# Altium project LB V01 R03.PrjPcb
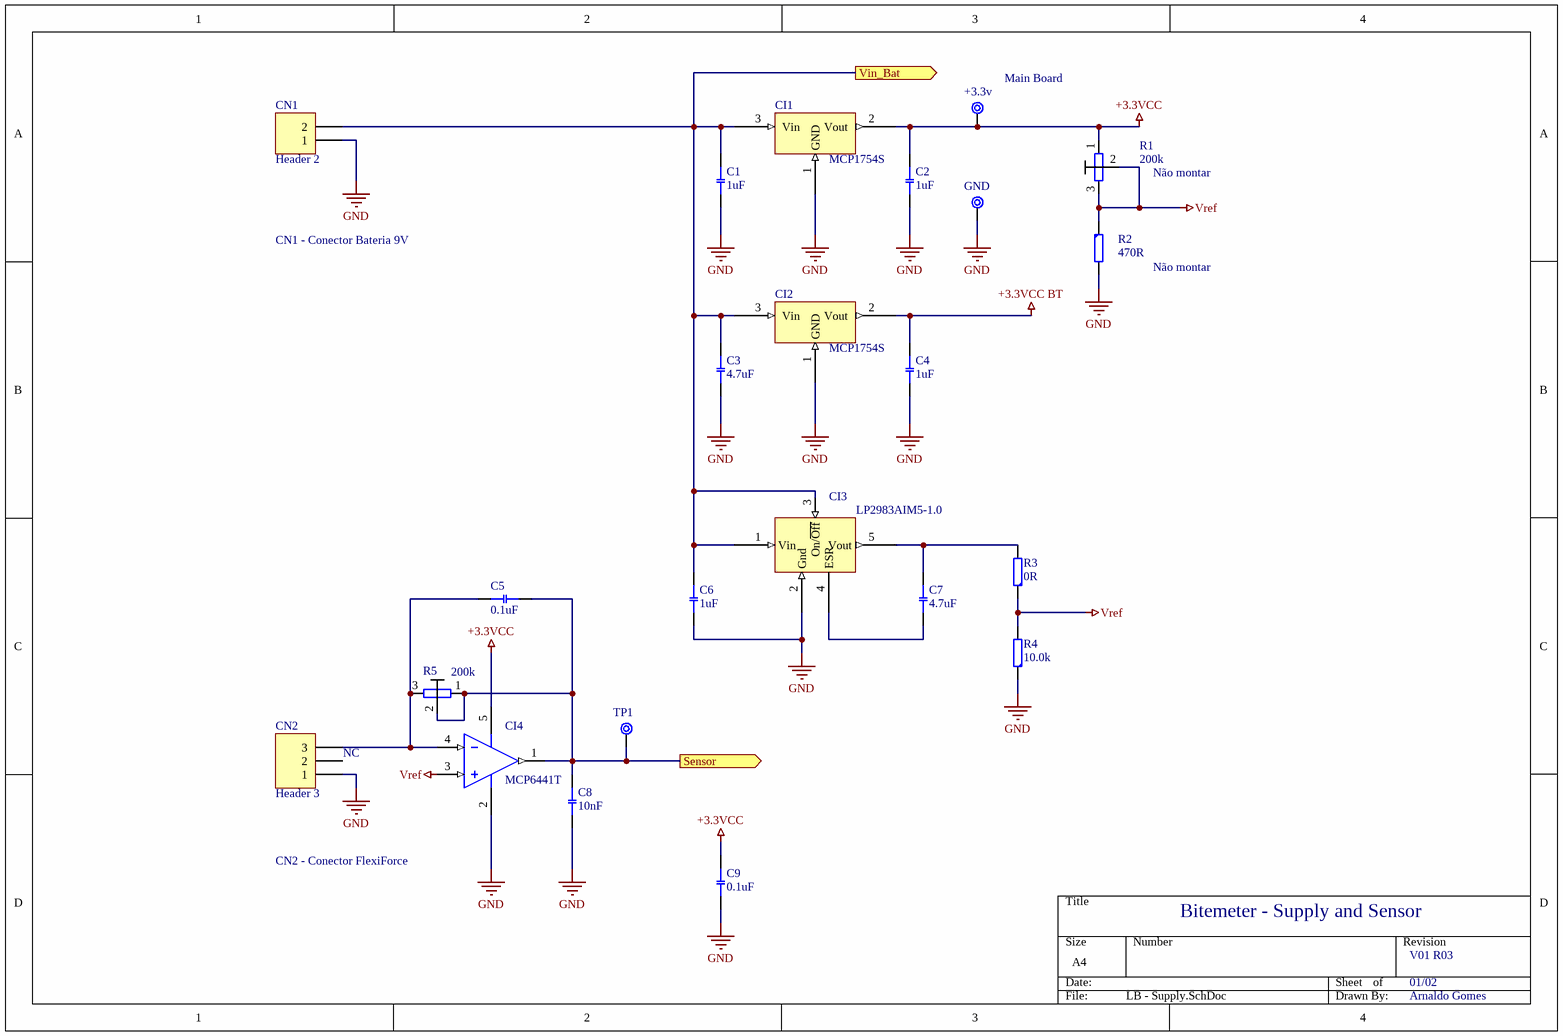
[diagram p0: LB - Supply.SchDoc]
2 sheets, 60 parts. Net scope: flat (ports and power ports of the same name join across sheets).
Board files: LB - PCB Route.PcbDoc, LB - PCB Route Sem a malha de terra.PcbDoc
Sheets:
  LB - Supply.SchDoc
  LB - MainBoard.SchDoc

## Sheet LB - Supply.SchDoc
size A4

### Parts
+3.3v  TP  [TPSMD]  (value not drawn)  (no BOM)
C1  1uF  [R0805]
C2  1uF  [R0805]
C3  4.7uF  [R0805]
C4  1uF  [R0805]
C5  0.1uF  [R0805]
C6  1uF  [R0805]
C7  4.7uF  [R0805]
C8  10nF  [R0805]
C9  0.1uF  [R0805]
CI1  MCP1754S  [SOT23-A MCP1754]
CI2  MCP1754S  [SOT23-A MCP1754]
CI3  LP2983AIM5-1.0  [SOT23-5 Amp Op]
CI4  MCP6441T  [SOT23-5 Amp Op]
CN1  Header 2  [HDR1X2]
CN2  Header 3  [HDR1X3]
GND  TP  [TPSMD]  (value not drawn)  (no BOM)
R1  200k  [3364X-1-503E]
R2  470R  [R0805]
R3  0R  [R0805]
R4  10.0k  [R0805]
R5  200k  [3364X-1-503E]
TP1  TP  [TPSMD]  (value not drawn)  (no BOM)

### Ports
Sensor (out), Vin_Bat (out)

### Nets
+3.3VCC: +3.3v.1 C2.2(B) C9.2(B) CI1.2(Vout) CI4.5(VDD) R1.1(B)
+3.3VCC BT: C4.2(B) CI2.2(Vout)
GND: C1.1(A) C2.1(A) C3.1(A) C4.1(A) C6.2(B) C8.1(A) C9.1(A) CI1.1(GND) CI2.1(GND) CI3.2(Gnd) CI4.2(VSS) CN1.1 CN2.1 GND.1 R2.2(B) R4.1(A)
Vref: CI4.3(Vin+) R1.2(C) R1.3(A) R2.1(A) R3.1(A) R4.2(B)
Sensor_Mord: C5.1(A) C8.2(B) CI4.1(Vout) R5.1(B) R5.2(C) TP1.1 ; port Sensor
NetC1_2: C1.2(B) C3.2(B) C6.1(A) CI1.3(Vin) CI2.3(Vin) CI3.1(Vin) CI3.3(On/~{Off}) CN1.2 ; port Vin_Bat
NetC5_2: C5.2(B) CI4.4(Vin-) CN2.3 R5.3(A)
NetC7_1: C7.1(A) CI3.4(ESR)
NetC7_2: C7.2(B) CI3.5(Vout) R3.2(B)

Not connected (* = marked no-connect by the designer): CN2 2

### Notes on the sheet
- (near +3.3v) Main Board
- (near R1) Não montar
- CN1 - Conector Bateria 9V
- Não montar
- (near CN2) NC
- CN2 - Conector FlexiForce
- Bitemeter - Supply and Sensor
- V01 R03
- 01/02
- Arnaldo Gomes

### Library data of the parts
+3.3v GND TP1 = TP: Test Point
C1 = C: Capictor Cerâmico 4.7uFx16V; PN_Fab: C2012X7R1C105K125AA; PN_For: 445-1358-1-ND; Ref_Fab: TDK Corporation; Ref_For: Digikey
C2 C4 C6 = C: Capictor Cerâmico 1uFx16V; PN_Fab: C2012X7R1C105K125AA; PN_For: 445-1358-1-ND; Ref_Fab: TDK Corporation; Ref_For: Digikey
C3 C7 = C: Capictor Cerâmico 4.7uFx16V; PN_Fab: C2012X7R1C475K125AB; PN_For: 445-6859-1-ND; Ref_Fab: TDK Corporation; Ref_For: Digikey
C5 C9 = C: Capacitor 0.1uFx25V; PN_Fab: C2012X7R1H104K085AA; PN_For: 445-7534-1-ND; Ref_Fab: Murata Electronics North America; Ref_For: Digikey
C8 = C: Capacitor 10nFx25V; PN_Fab: C2012C0G1H103K060AA; PN_For: 445-14311-1-ND; Ref_Fab: TDK Corporation; Ref_For: Digikey
CI1 CI2 = Regulador 3.3V - SOT223-3, 4-Leads, Body 6.50x7.00mm (avg), Pitch 2.30mm, IPC Medium_1: Regulador 3.3V MCP1754S; PN_Fab: MCP1754ST-3302E/CB; PN_For: MCP1754ST-3302E/CBCT-ND; Ref_Fab: Microchip Technology; Ref_For: Digikey
CI3 = Regulador 1.0V - SOT23-5: Regulador 1.0V; LP2983AIM5-1.0/NOPB: PN_Fab; LP2983AIM5-1.0/NOPBCT-ND: PN_For; Texas Instruments: Ref_Fab; Digikey: Ref_For
CI4 = Amp Op: Amp Op Rail-to-Rail; PN_Fab: MCP6441T-E/OT; PN_For: MCP6441T-E/OTCT-ND; Ref_Fab: Linear Technology; Ref_For: Digikey
CN1 = Conector Alimentação: Header, 2-Pin; Ref_Fab: TE Connectivity; Ref_For: Digikey; PN_Fab: 640456-2; PN_For: A1921-ND
CN2 = Conector Sensor: Header, 3-Pin; PN_Fab: 640457-3; PN_For: A19480-ND; Ref_For: TE Connectivity; Ref_For: Digikey
R1 = Trimpot: Trimpot 200k; PN_Fab: 3364X-1-204E; PN_For: 3364X-204ETR-ND; Ref_Fab: Bourns Inc.; Ref_For: Digikey
R2 = R: PN_Fab: MCR10ERTJ471; PN_For: RHM470CPCT-ND; Ref_Fab: Rohm Semiconductor; Ref_For: Digikey
R3 = R: PN_Fab: RHM0.0CPCT-ND; PN_For: MCR10ERTJ000; Ref_Fab: Rohm Semiconductor; Ref_For: Digikey
R4 = R: PN_Fab: MCR10ERTF1002; PN_For: RHM10.0KCHCT-ND; Ref_Fab: Rohm Semiconductor; Ref_For: Digikey
R5 = Trimpot: Trimpot 500k; PN_Fab: 3364X-1-504E; PN_For: 3364X-504ECT-ND; Ref_Fab: Bourns Inc.; Ref_For: Digikey

## Sheet LB - MainBoard.SchDoc
size A4
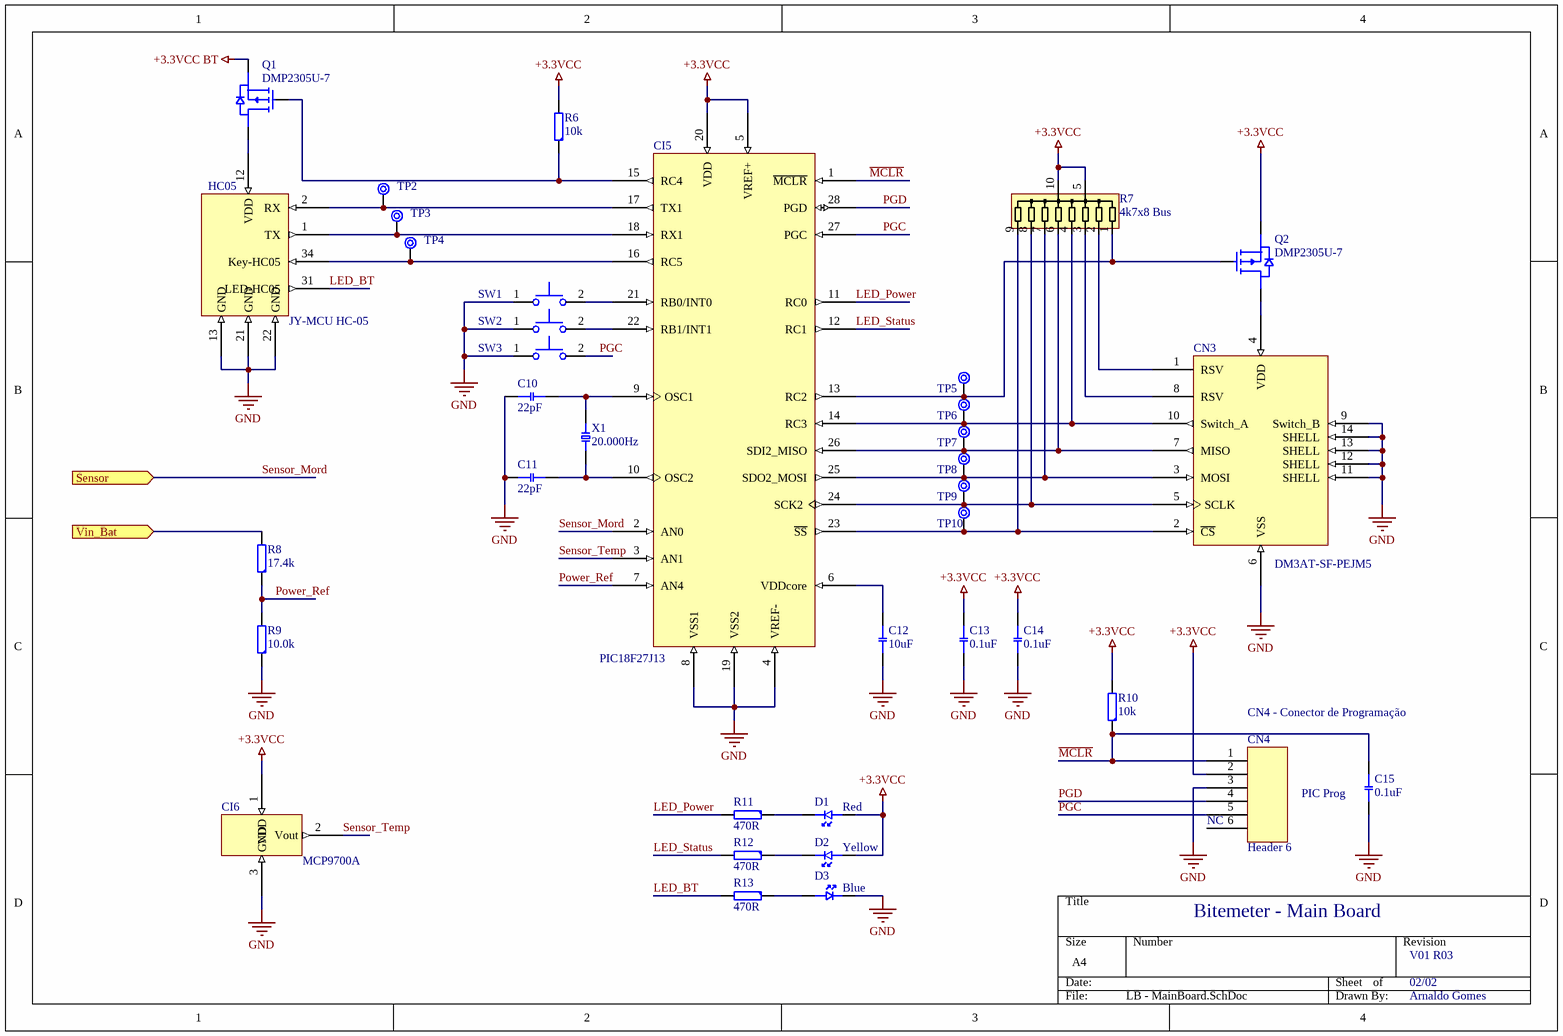
[diagram p1: LB - MainBoard.SchDoc]

### Parts
C10  22pF  [R0805]
C11  22pF  [R0805]
C12  10uF  [R0805]
C13  0.1uF  [R0805]
C14  0.1uF  [R0805]
C15  0.1uF  [R0805]
CI5  PIC18F27J13  [PIC24F16KL402]
CI6  MCP9700A  [MCP9700A]
CN3  DM3AT-SF-PEJM5  [DM3AT]
CN4  Header 6  [HDR1X6]
D1  Red  [LTST-C930]
D2  Yellow  [LTST-C930]
D3  Blue  [LTST-C930]
HC05  JY-MCU HC-05  [JY-MCU HC-05]
Q1  DMP2305U-7  [DMP2305U-7]
Q2  DMP2305U-7  [DMP2305U-7]
R6  10k  [R0805]
R7  4k7x8 Bus  [MMR15 Mod]
R8  17.4k  [R0805]
R9  10.0k  [R0805]
R10  10k  [R0805]
R11  470R  [R0805]
R12  470R  [R0805]
R13  470R  [R0805]
SW1  (no value)  [Push Button2]
SW2  (no value)  [Push Button2]
SW3  (no value)  [Push Button2]
TP2  TP  [TPSMD]  (value not drawn)  (no BOM)
TP3  TP  [TPSMD]  (value not drawn)  (no BOM)
TP4  TP  [TPSMD]  (value not drawn)  (no BOM)
TP5  TP  [TPSMD]  (value not drawn)  (no BOM)
TP6  TP  [TPSMD]  (value not drawn)  (no BOM)
TP7  TP  [TPSMD]  (value not drawn)  (no BOM)
TP8  TP  [TPSMD]  (value not drawn)  (no BOM)
TP9  TP  [TPSMD]  (value not drawn)  (no BOM)
TP10  TP  [TPSMD]  (value not drawn)  (no BOM)
X1  20.000Hz  [ABM3]

### Ports
Sensor (in), Vin_Bat (in)

### Nets
+3.3VCC: C13.2(B) C14.2(B) CI5.5(VREF+) CI5.20(VDD) CI6.1(VDD) CN4.2 D1.A D2.A Q2.S R6.2(B) R7.5 R7.10 R10.2(B)
+3.3VCC BT: Q1.S
GND: C10.2(B) C11.2(B) C12.1(A) C13.1(A) C14.1(A) C15.1(A) CI5.4(VREF-) CI5.8(VSS1) CI5.19(VSS2) CI6.3(GND) CN3.6(VSS) CN3.9(Switch_B) CN3.11(SHELL) CN3.12(SHELL) CN3.13(SHELL) CN3.14(SHELL) CN4.3 D3.K HC05.13(GND) HC05.21(GND) HC05.22(GND) R9.1(A) SW1.1 SW2.1 SW3.1
LED_BT: HC05.31(LED-HC05) R13.2(B)
LED_Power: CI5.11(RC0) R11.2(B)
LED_Status: CI5.12(RC1) R12.2(B)
~{MCLR}: C15.2(B) CI5.1(~{MCLR}) CN4.1 R10.1(A)
PGC: CI5.27(PGC) CN4.5 SW3.2
PGD: CI5.28(PGD) CN4.4
Power_Ref: CI5.7(AN4) R8.1(A) R9.2(B)
Sensor_Mord: CI5.2(AN0) ; port Sensor
Sensor_Temp: CI5.3(AN1) CI6.2(Vout)
NetC1_2: R8.2(B) ; port Vin_Bat
NetC10_1: C10.1(A) CI5.9(OSC1) X1.1(A)
NetC11_1: C11.1(A) CI5.10(OSC2) X1.2(B)
NetC12_2: C12.2(B) CI5.6(VDDcore)
NetCI5_13: CI5.13(RC2) Q2.G R7.1 TP5.1
NetCI5_14: CI5.14(RC3) CN3.10(Switch_A) R7.4 TP6.1
NetCI5_15: CI5.15(RC4) Q1.G R6.1(A)
NetCI5_16: CI5.16(RC5) HC05.34(Key-HC05) TP4.1
NetCI5_17: CI5.17(TX1) HC05.2(RX) TP2.1
NetCI5_18: CI5.18(RX1) HC05.1(TX) TP3.1
NetCI5_21: CI5.21(RB0/INT0) SW1.2
NetCI5_22: CI5.22(RB1/INT1) SW2.2
NetCI5_23: CI5.23(~{SS}) CN3.2(~{CS}) R7.9 TP10.1
NetCI5_24: CI5.24(SCK2) CN3.5(SCLK) R7.8 TP9.1
NetCI5_25: CI5.25(SDO2_MOSI) CN3.3(MOSI) R7.7 TP8.1
NetCI5_26: CI5.26(SDI2_MISO) CN3.7(MISO) R7.6 TP7.1
NetCN3_1: CN3.1(RSV) R7.2
NetCN3_4: CN3.4(VDD) Q2.D
NetCN3_8: CN3.8(RSV) R7.3
NetD1_K: D1.K R11.1(A)
NetD2_K: D2.K R12.1(A)
NetD3_A: D3.A R13.1(A)
NetHC05_12: HC05.12(VDD) Q1.D

Not connected (* = marked no-connect by the designer): CN4 6

### Notes on the sheet
- CN4 - Conector de Programação
- (near CN4) NC
- (near C15) PIC Prog
- Bitemeter - Main Board
- V01 R03
- 02/02
- Arnaldo Gomes

### Library data of the parts
C10 C11 = C: Capacitor 22pF; PN_Fab: GQM2195C1H220JB01D; PN_For: 490-3608-2-ND; Ref_Fab: Murata Electronics North America; Ref_For: Digikey
C12 = C: Capacitor 10uFx6.3V; PN_Fab: GRM21BR60J106ME19L; PN_For: 490-1718-1-ND; Ref_Fab: Murata Electronics North America; Ref_For: Digikey
C13-C15 = C: as C5 on sheet LB - Supply
CI5 = PIC18F27J13: PIC18 8Bits; PN_Fab: PIC18F27J13-I/SO; PN_For: PIC18F27J13-I/SO-ND; Ref_Fab: Microchip Technology; Ref_For: Digikey
CI6 = MCP9700A: Sensor de temperatura; PN_For: MCP9700AT-E/TTCT-ND; PN_Fab: MCP9700AT-E/TT; Ref_Fab: Microchip; Ref_For: Digikey
CN3 = MicroSD - DM3CS-SF: Slot Micro SD - Push-Pull; PN_For: HR1964CT-ND; Ref_Fab: Hirose Electric Co Ltd; Ref_For: Digikey; PN_Fab: DM3AT-SF-PEJM5
CN4 = Conector Programação: Header, 6-Pin; PN_Fab: 534237-4; PN_For: A26418-ND; Ref_Fab: TE Connectivity; Ref_For: Digikey
D1 = LED: PN_Fab: LTST-C930KRKT; PN_For: 160-1463-2-ND; Ref_Fab: Lite-On Inc; Ref_For: Digikey
D2 = LED: PN_Fab: LTST-C930KSKT; PN_For: 160-1464-1-ND; Ref_Fab: Lite-On Inc; Ref_For: Digikey
D3 = LED: PN_Fab: LTST-C930TBKT; PN_For: 160-1649-1-ND; Ref_Fab: Lite-On Inc; Ref_For: Digikey
HC05 = JY-MCU HC-05: Modulo Bluetooth HC-05; Ref_For: Deal Extreme; PN_Fab: JY-MCU HC-05; PN_For: JY-MCU HC-05; Ref_Fab: *
Q1 = MOSFET-P DIODE: MOSFET-P; PN_For: DMP2305UDICT-ND; Ref_Fab: Diodes Incorporated; Ref_For: Digikey; PN_Fab: DMP2305U-7
Q2 = MOSFET-P DIODE: MOSFET-P; PrjPn: P1301-0086; Ref1_Fab: Diodes Inc; Ref1_ForPn: DMP2305UDICT-ND; Ref1_For: Digikey; DvxPn: *; Ref1_Pn: DMP2305U-7; Ref1_Datasheet: *
R6 R10 = R: PN_Fab: MCR10ERTJ103; PN_For: RHM10KCPCT-ND; Ref_Fab: Rohm Semiconductor; Ref_For: Digikey
R7 = R ARRAY BUS 8 - 10 PIN: Brigde 4k7x8; PN_Fab: MNR15ERRPJ472; PN_For: RHM1615CT-ND; Ref_Fab: Rohm Semiconductor; Ref_For: Digikey
R8 = R: PN_Fab: KTR10EZPF1742; PN_For: RHM17.4KAHCT-ND; Ref_Fab: Rohm Semiconductor; Ref_For: Digikey
R9 = R: as R4 on sheet LB - Supply
R11 R12 = R: as R2 on sheet LB - Supply
R13 = R: PN_Fab: MCR10ERTJ471; PN_For: RHM220CPCT-ND; Ref_Fab: Rohm Semiconductor; Ref_For: Digikey
SW1-SW3 = Push button: PN_Fab: FSM6JSMA; PN_For: 450-1133-ND; Ref_Fab: TE Connectivity; Ref_For: Digikey
TP2-TP10 = TP: Test Point
X1 = XTAL: Crystal 20.000Hz; PN_Fab: ABM3-20.000MHZ-B2-T; PN_For: 535-9105-1-ND; Ref_Fab: Abracon Corporation; Ref_For: Digikey

## Nets that join several sheets
+3.3VCC: LB - Supply (6 pins), LB - MainBoard (13 pins)
+3.3VCC BT: LB - Supply (C4.2 CI2.2), LB - MainBoard (Q1.S)
GND: LB - Supply (16 pins), LB - MainBoard (25 pins)
NetC1_2: LB - Supply (8 pins), LB - MainBoard (R8.2)
Sensor_Mord: LB - Supply (6 pins), LB - MainBoard (CI5.2)